# EasyEDA Pro project ProPrj_MBC5 电池 (ldo)定稿_2024-09-28.epro, schematic schematic1
Create Date: 2024-04-18; Page Name: P1; Project Name: mbc5flash 电池(ldo) test1; Schematic Name: schematic1; Update Date: 2024-04-28; Company: 嘉立创EDA; Page Size: A4; Version: V1.0
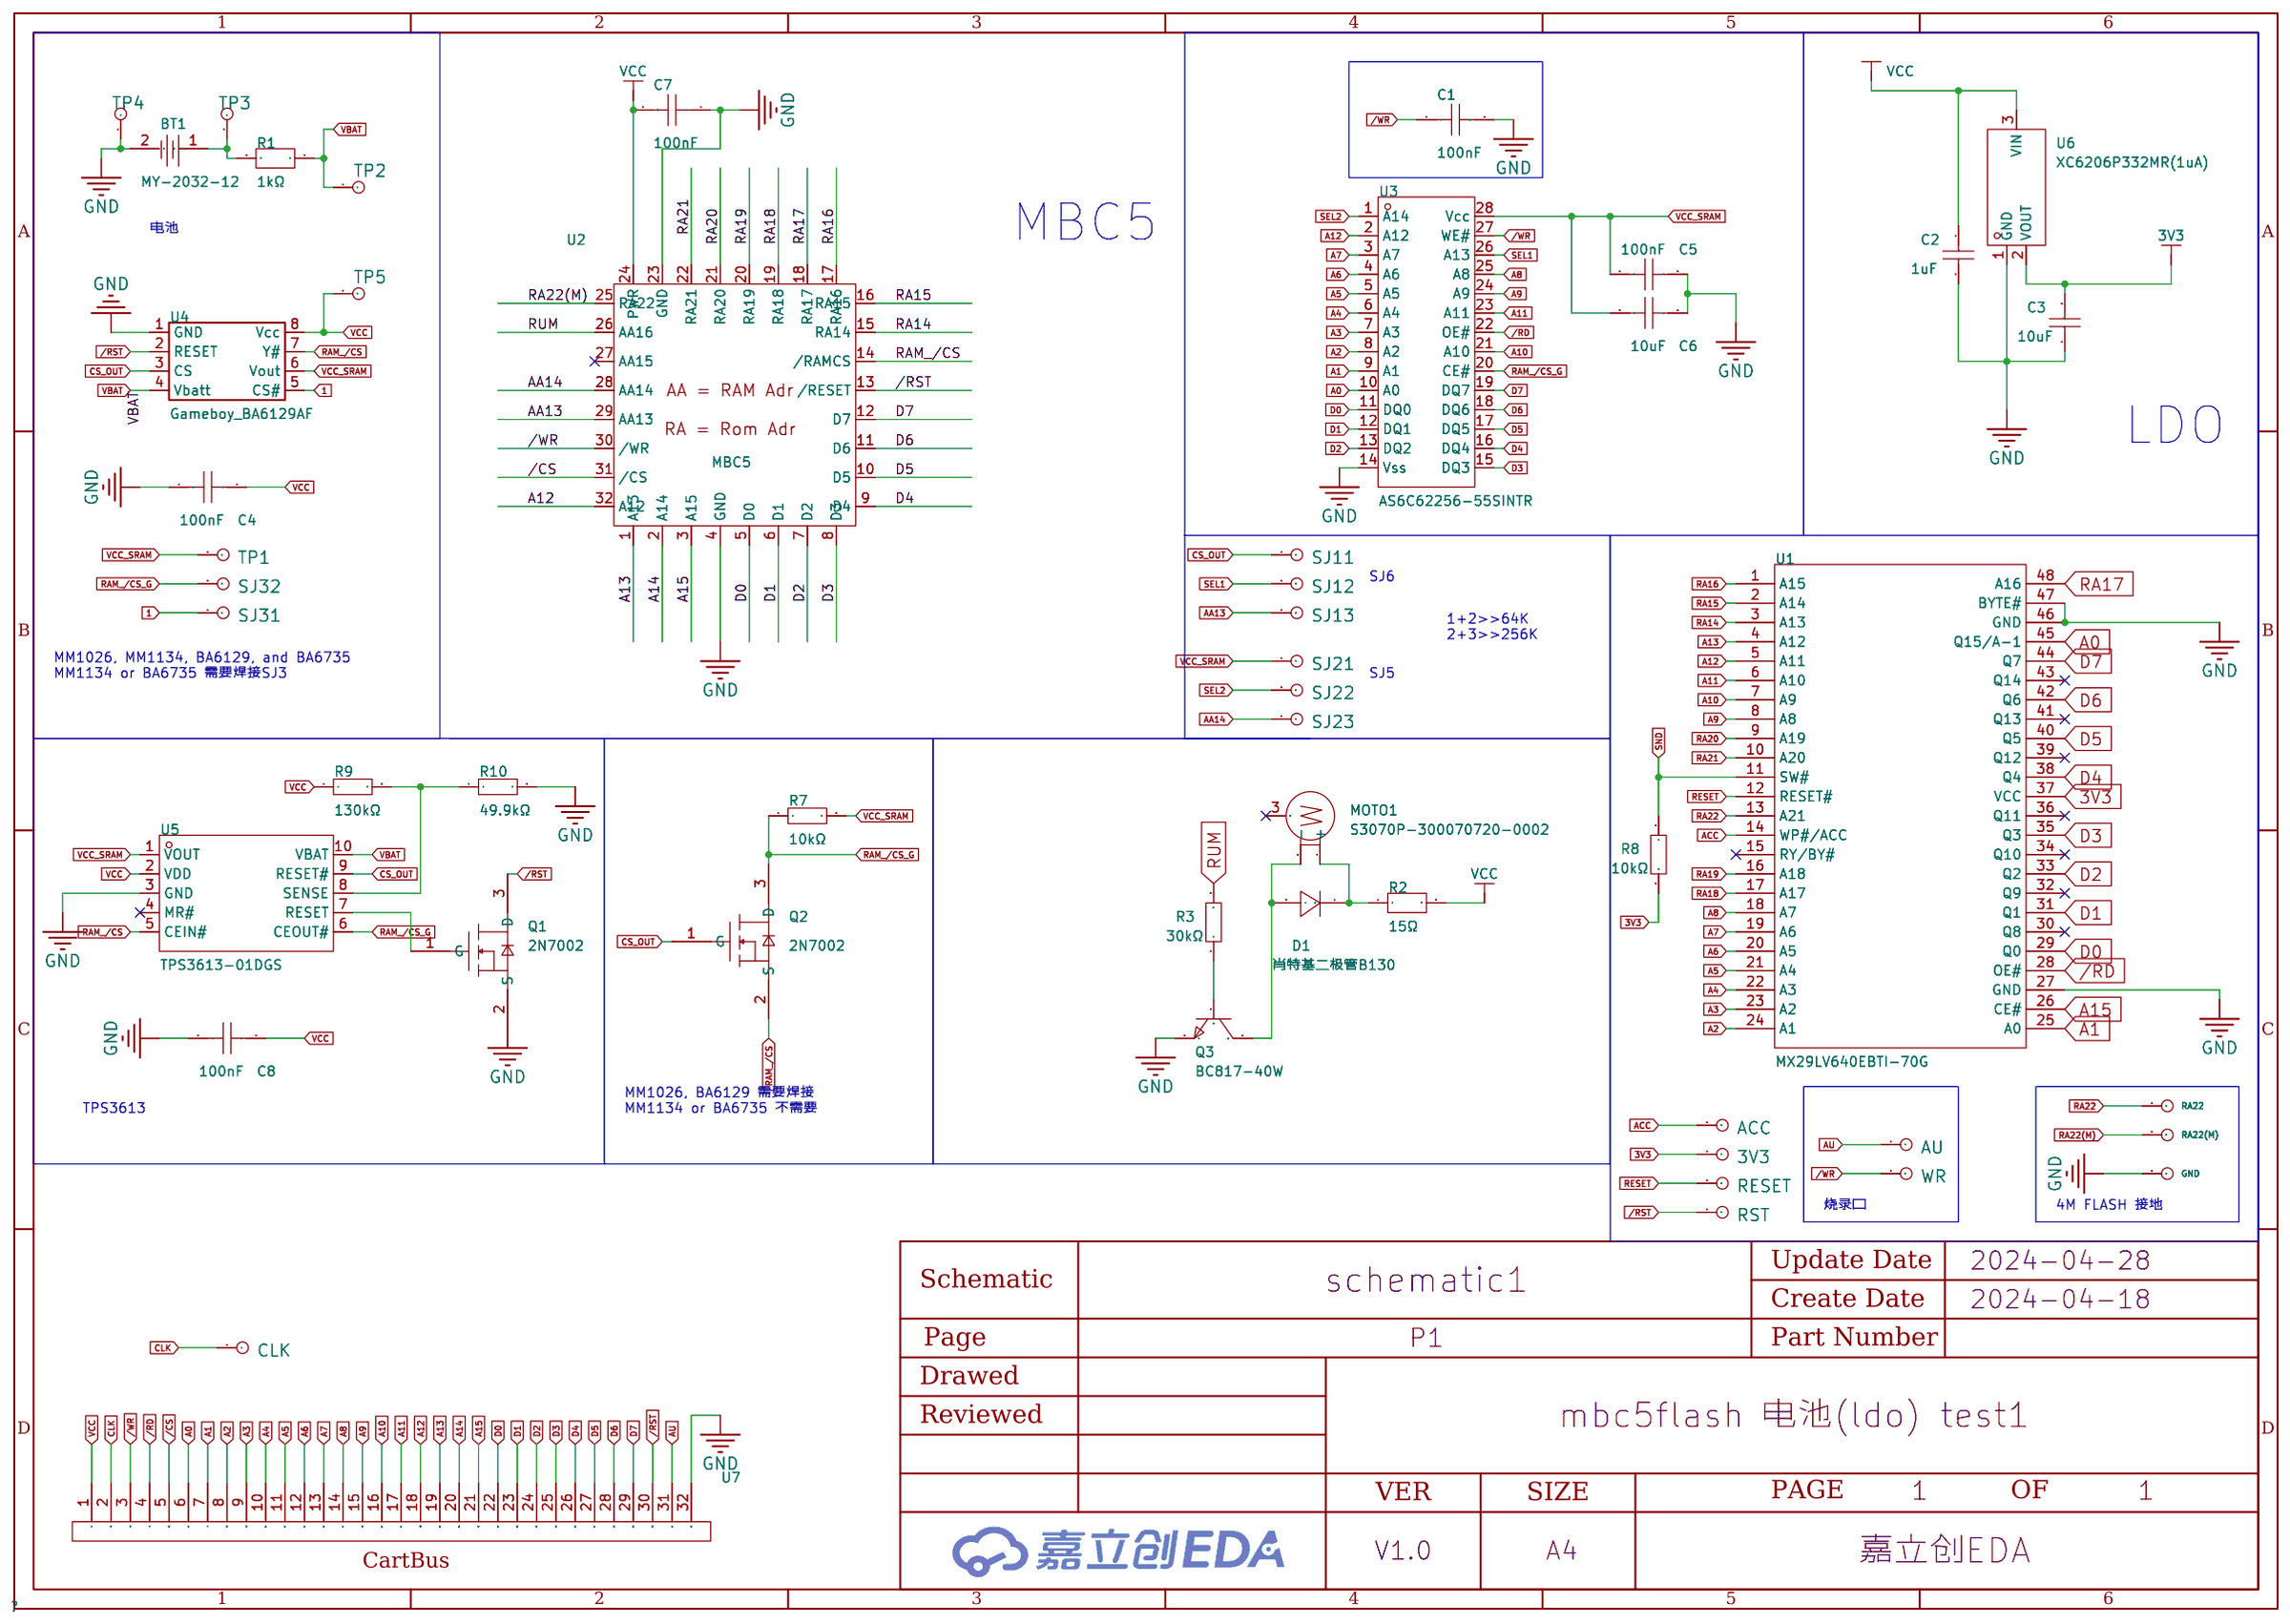
[diagram p0: schematic sheet]

## Parts
3V3  RTC_VOUT  [test_1p]
ACC  RTC_VOUT  [test_1p]
AU  RTC_VOUT  [test_1p]
BT1  MY-2032-12  [BAT-SMD_MY-2032-12]
C1  100nF  [C0603]
C2  1uF  [C0603]
C3  10uF  [C0603]
C4  100nF  [C0603]
C5  100nF  [C0603]
C6  10uF  [C0603]
C7  100nF  [C0603]
C8  100nF  [C0603]
CLK  RTC_VOUT  [test_1p]
D1  肖特基二极管B130  [SOD-123_L2.7-W1.7-LS3.8-RD]
GND  Battery_Positive_After_Resistor  [test_1p]
MOTO1  S3070P-300070720-0002  [VIBRATING-MOTOR_S3070P-300070720-0002]
Q1  2N7002  [SOT-23-3_L2.9-W1.3-P1.90-LS2.4-BR]
Q2  2N7002  [SOT-23-3_L2.9-W1.3-P1.90-LS2.4-BR]
Q3  BC817-40W  [SOT-323-3_L2.1-W1.3-P1.30-LS2.3-BR]
R1  1kΩ  [R0603]
R2  15Ω  [R0603]
R3  30kΩ  [R0603]
R7  10kΩ  [R0603]
R8  10kΩ  [R0603]
R9  130kΩ  [R0603]
R10  49.9kΩ  [R0603]
RA22  RTC_VOUT  [test_1p]
RA22(M)  RTC_VOUT  [test_1p]
RESET  RTC_VOUT  [test_1p]
RST  RTC_VOUT  [test_1p]
SJ11  RTC_VOUT  [test_1p]
SJ12  RTC_VOUT  [test_1p]
SJ13  RTC_VOUT  [test_1p]
SJ21  RTC_VOUT  [test_1p]
SJ22  RTC_VOUT  [test_1p]
SJ23  RTC_VOUT  [test_1p]
SJ31  RTC_VOUT  [test_1p]
SJ32  RTC_VOUT  [test_1p]
TP1  RTC_VOUT  [test_1p]
TP2  RTC_VOUT  [test_1p]
TP3  RTC_VOUT  [test_1p]
TP4  RTC_VOUT  [test_1p]
TP5  RTC_VOUT  [test_1p]
U1  MX29LV640EBTI-70G  [TSOP-48_L12.0-W18.4-P0.50-LS20.0-TL]
U2  MBC5  [MBC5]
U3  AS6C62256-55SINTR  [SOP-28_L18.0-W8.4-P1.27-LS11.8-BL]
U4  BA6129AF  [Package_SO:SOIC-8_3.9x4.9mm_P1.27mm]
U5  TPS3613-01DGS  [MSOP-10_L3.0-W3.0-P0.50-LS5.0-BL]
U6  XC6206P332MR(1uA)  [SOT-23-3_L2.9-W1.6-P1.90-LS2.8-BR]
U7  -  [GBGBA CARTBUS]
WR  RTC_VOUT  [test_1p]

## Library data of the parts
3V3 ACC AU CLK GND RA22 RA22(M) RESET RST SJ11-SJ13 SJ21-SJ23 SJ31 SJ32 TP1-TP5 WR = Connector_TestPoint
BT1 = MY-2032-12: LCSC Part Name: CR2032 电池扣; Supplier Part: C964833; Manufacturer: MYOUNG(美阳); Supplier Footprint: SMT; JLCPCB Part Class: Extended Part; Datasheet: https://atta.szlcsc.com/upload/public/pdf/source/20201218/C964833_8D2DD5FC6B310B5B4EFEF4B683694189.pdf; Supplier: LCSC
C1 C4 C8 = CL10B104KB8NNNC: 容值:100nF;精度:±10%;额定电压:50V;材质(温度系数):X7R;; LCSC Part Name: 100nF ±10% 50V; Supplier Part: C1591; Manufacturer: SAMSUNG(三星); Supplier Footprint: 0603; JLCPCB Part Class: Extended Part; Datasheet: https://atta.szlcsc.com/upload/public/pdf/source/20160103/1457707680512.pdf; Supplier: LCSC; Tolerance: ±10%; Voltage Rated: 50V; Temperature Coefficient: X7R
C2 C3 = CL10A105KB8NNNC: 温度系数:X5R;精度:±10%;额定电压:50V;容值:1uF;; LCSC Part Name: 1uF ±10% 50V; Supplier Part: C15849; Manufacturer: SAMSUNG(三星); Supplier Footprint: 0603; JLCPCB Part Class: Basic Part; Datasheet: https://atta.szlcsc.com/upload/public/pdf/source/20160103/1457707679084.pdf; Supplier: LCSC; Temperature Coefficient: X5R; Tolerance: ±10%; Voltage Rated: 50V
C5 = CC0603KRX7R9BB104: 容值:100nF;精度:±10%;额定电压:50V;材质(温度系数):X7R;; LCSC Part Name: 100nF ±10% 50V; Supplier Part: C14663; Manufacturer: YAGEO(国巨); Supplier Footprint: 0603; JLCPCB Part Class: 基础库; Datasheet: https://atta.szlcsc.com/upload/public/pdf/source/20180910/C282072_33301C7F631E79921B82A8DAC6BCC5B3.pdf; Supplier: LCSC; Tolerance: ±10%; Voltage Rated: 50V; Temperature Coefficient: X7R
C6 = CL10A106KP8NNNC: 容值:10uF;精度:±10%;额定电压:10V;材质(温度系数):X5R;; LCSC Part Name: 10uF ±10% 10V; Supplier Part: C19702; Manufacturer: SAMSUNG(三星); Supplier Footprint: 0603; JLCPCB Part Class: 基础库; Datasheet: https://atta.szlcsc.com/upload/public/pdf/source/20160218/1457707763339.pdf; Supplier: LCSC; Tolerance: ±10%; Voltage Rated: 10V; Temperature Coefficient: X5R
C7 = CC0603KRX7R9BB104: 容值:100nF;精度:±10%;额定电压:50V;材质(温度系数):X7R;; LCSC Part Name: 100nF ±10% 50V; Supplier Part: C14663; Manufacturer: YAGEO(国巨); Supplier Footprint: 0603; JLCPCB Part Class: Basic Part; Datasheet: https://atta.szlcsc.com/upload/public/pdf/source/20170116/1484561234239.pdf; Supplier: LCSC; Tolerance: ±10%; Voltage Rated: 50V; Temperature Coefficient: X7R
D1 = 肖特基二极管B130: Supplier Part: C9900019643; Supplier Footprint: D1005; JLCPCB Part Class: 扩展库; Supplier: LCSC
MOTO1 = S3070P-300070720-0002: 类型:扁平振动马达;额定电压:2.7V;额定转速:14000±2500rpm;旋转方向:CW;; LCSC Part Name: 实芯马达; Supplier Part: C2685995; Manufacturer: LNLON(灵龙); JLCPCB Part Class: 扩展库; Datasheet: https://atta.szlcsc.com/upload/public/pdf/source/20210121/C2685995_E06BF4A387E18BA7CEE2C0FD22C45624.pdf; Supplier: LCSC; Type: 扁平振动马达; Rated Voltage: 2.7V; Rated Current: 85mA; Rated Speed: 14000±2500rpm; Operating Temperature: -20℃~+70℃; Sense Of Rotation: CW
Q1 Q2 = 2N7002_C916396: 类型:N沟道;漏源电压(Vdss):60V;连续漏极电流(Id):115mA;功率(Pd):200mW;导通电阻(RDS(on)@Vgs,Id):1.2Ω@10V,500mA;阈值电压(Vgs(th)@Id):2.1V@250uA;; LCSC Part Name: N沟道 耐压:60V 电流:115mA; Supplier Part: C916396; Manufacturer: JSMSEMI(杰盛微); Supplier Footprint: SOT-23; JLCPCB Part Class: 扩展库; Datasheet: https://atta.szlcsc.com/upload/public/pdf/source/20230714/89F30C6A193AD72E5F1F14B53E304F4A.pdf; Supplier: LCSC; Type: N沟道; Drain Source Voltage (Vdss): 60V; Continuous Drain Current (Id): 115mA; Power Dissipation (Pd): 200mW; Drain Source On Resistance (RDS(on)@Vgs,Id): 1.2Ω@10V,500mA; Gate Threshold Voltage (Vgs(th)@Id): 2.1V@250uA; Input Capacitance (Ciss@Vds): 20pF@25V; Reverse Transfer Capacitance (Crss@Vds): 4pF@25V
Q3 = BC817-40W_C17703043: 晶体管类型:NPN;集电极电流(Ic):500mA;集射极击穿电压(Vceo):45V;功率(Pd):200mW;; LCSC Part Name: 耐压:45V 电流:500mA NPN; Supplier Part: C17703043; Manufacturer: MSKSEMI(美森科); Supplier Footprint: SOT-323; Datasheet: https://atta.szlcsc.com/upload/public/pdf/source/20230927/BC1FC2DBB8D608A648B3A61BC7D80A24.pdf; Supplier: LCSC; Transistor Type: NPN; Collector Current (Ic): 500mA; Collector-Emitter Breakdown Voltage (Vceo): 45V; Power Dissipation (Pd): 200mW
R1 = ERA3VEB1001V: 温度系数:±25ppm/K;温度系数:±25ppm/K;工作温度范围:-55℃~+155℃;工作温度范围:-55℃~+155℃;精度:±0.1%;最大工作电压:100V;类型:薄膜电阻;功率:125mW;阻值:1kΩ;; LCSC Part Name: 1KΩ(1001) ±0.1%; Supplier Part: C490794; Manufacturer: PANASONIC(松下); Supplier Footprint: 0603; JLCPCB Part Class: Extended Part; Datasheet: https://atta.szlcsc.com/upload/public/pdf/source/20200407/C490794_144E786BD6B5906C11E86C00580B1EF5.pdf; Supplier: LCSC; Temperature Coefficient: ±25ppm/K; Operating Temperature Range: -55℃~+155℃; Tolerance: ±0.1%; Overload Voltage (Max): 100V; Type: 薄膜电阻; Power(Watts): 125mW
R2 = SCR0603J15R: 电阻类型:厚膜电阻;阻值:15Ω;精度:±5%;功率:100mW;最大工作电压:75V;; LCSC Part Name: 厚膜电阻 15Ω ±5% 100mW; Supplier Part: C3017777; Manufacturer: VO(翔胜); Supplier Footprint: 0603; JLCPCB Part Class: 扩展库; Datasheet: https://atta.szlcsc.com/upload/public/pdf/source/20220513/247AF9639BA21CF93567DC289CCC6A22.pdf; Supplier: LCSC; Type: 厚膜电阻; Tolerance: ±5%; Power(Watts): 100mW; Overload Voltage (Max): 75V; Operating Temperature Range: -55℃~+155℃
R3 = ERJPA3F3002V: 电阻类型:厚膜电阻;阻值:30kΩ;精度:±1%;功率:250mW;最大工作电压:-;温度系数:±100ppm/℃;; LCSC Part Name: 30kΩ ±1% 250mW 厚膜电阻; Supplier Part: C543380; Manufacturer: PANASONIC(松下); Supplier Footprint: 0603; JLCPCB Part Class: 扩展库; Datasheet: https://atta.szlcsc.com/upload/public/pdf/source/20200515/C543414_D3FB4A44C151AC19BA141503575FC797.pdf; Supplier: LCSC; Type: 厚膜电阻; Tolerance: ±1%; Power(Watts): 250mW; Temperature Coefficient: ±100ppm/℃; Operating Temperature Range: -55℃~+155℃
R7 R8 = 0603WAF1002T5E: 电阻类型:厚膜电阻;阻值:10kΩ;精度:±1%;功率:100mW;温度系数:±100ppm/℃;最大工作电压:75V;工作温度范围:-55℃~+155℃;; LCSC Part Name: 10kΩ ±1% 100mW; Supplier Part: C25804; Manufacturer: UNI-ROYAL(厚声); Supplier Footprint: 0603; JLCPCB Part Class: Basic Part; Datasheet: https://atta.szlcsc.com/upload/public/pdf/source/20200306/C422600_1E6D84923E4A46A82E41ADD87F860B5C.pdf; Supplier: LCSC; Type: 厚膜电阻; Tolerance: ±1%; Power(Watts): 100mW; Temperature Coefficient: ±100ppm/℃; Overload Voltage (Max): 75V; Operating Temperature Range: -55℃~+155℃
R9 = 0603WAF1303T5E: 电阻类型:厚膜电阻;阻值:130kΩ;精度:±1%;功率:100mW;最大工作电压:75V;温度系数:±100ppm/℃;; LCSC Part Name: 130kΩ ±1% 100mW 厚膜电阻; Supplier Part: C22795; Manufacturer: UNI-ROYAL(厚声); Supplier Footprint: 0603; JLCPCB Part Class: 扩展库; Datasheet: https://atta.szlcsc.com/upload/public/pdf/source/20200306/C422600_1E6D84923E4A46A82E41ADD87F860B5C.pdf; Supplier: LCSC; Type: 厚膜电阻; Tolerance: ±1%; Power(Watts): 100mW; Overload Voltage (Max): 75V; Temperature Coefficient: ±100ppm/℃; Operating Temperature Range: -55℃~+155℃
R10 = 0603WAF4992T5E: 电阻类型:厚膜电阻;阻值:49.9kΩ;精度:±1%;功率:100mW;最大工作电压:75V;温度系数:±100ppm/℃;; LCSC Part Name: 49.9kΩ ±1% 100mW 厚膜电阻; Supplier Part: C23184; Manufacturer: UNI-ROYAL(厚声); Supplier Footprint: 0603; JLCPCB Part Class: 基础库; Datasheet: https://atta.szlcsc.com/upload/public/pdf/source/20200306/C422600_1E6D84923E4A46A82E41ADD87F860B5C.pdf; Supplier: LCSC; Type: 厚膜电阻; Tolerance: ±1%; Power(Watts): 100mW; Overload Voltage (Max): 75V; Temperature Coefficient: ±100ppm/℃; Operating Temperature Range: -55℃~+155℃
U1 = MX29LV640EBTI-70G: 64-Mbit(8M x 8bit/4M x 16bit)，工作电压：2.7V to 3.6V; Supplier Part: C30076; Manufacturer: MXIC(旺宏电子); Supplier Footprint: TSOPI-48; JLCPCB Part Class: 扩展库; Datasheet: https://atta.szlcsc.com/upload/public/pdf/source/20140417/1457707044232.pdf; Supplier: LCSC
U2 = MBC5
U3 = AS6C62256-55SINTR: LCSC Part Name: AS6C62256 55SINTR; Supplier Part: C1858331; Manufacturer: Alliance Memory; Supplier Footprint: SOP-28-8.4mm; JLCPCB Part Class: 扩展库; Datasheet: https://atta.szlcsc.com/upload/public/pdf/source/20210505/A57C33C76897483B08DD4B91757DEAC7.pdf; Supplier: LCSC
U4 = BA6129AF
U5 = TPS3613-01DGS: 复位有效电平:低电平有效；高电平有效;受监控电压数:1;复位超时:60ms;; Supplier Part: C2867167; Manufacturer: TI(德州仪器); Supplier Footprint: MSOP-10; JLCPCB Part Class: 扩展库; Datasheet: https://www.ti.com/cn/lit/gpn/tps3613-01; Supplier: LCSC; ChipType: 电池备用电路; Output Type: 推挽; Reset Active Level: 低电平有效；高电平有效; Number of Voltages Monitored: 1; Reset Timeout: 60ms; Operating Temperature: -40℃~+85℃@(TA)
U6 = XC6206P332MR(1uA): 输出类型:-;; Supplier Part: C2827648; Manufacturer: TECH PUBLIC(台舟); Supplier Footprint: SOT-23-3L; JLCPCB Part Class: Extended Part; Datasheet: https://atta.szlcsc.com/upload/public/pdf/source/20210810/97CC0812A7725EE2472CEA147F9F2323.pdf; Supplier: LCSC
U7 = GB GBA CartBus

## Nets
3V3: 3V3.1 C3.2 R8.2 U1.37(VCC) U6.2(VOUT)
GND: BT1.2 C1.2 C2.1 C3.1 C4.1 C5.2 C6.2 C7.1 C8.1 GND.1 Q1.2(S) Q3.2(E) R10.2 TP4.1 U1.27(GND) U1.46(GND) U1.47(BYTE#) U2.4(GND) U2.23(GND) U3.14(Vss) U4.1(GND) U5.3(GND) U6.1(GND) U7.32
VBAT: R1.1 TP2.1 U4.4(Vbatt) U5.10(VBAT)
VCC: C2.2 C4.2 C7.2 C8.2 R2.2 R9.1 TP5.1 U2.24(PWR) U4.8(Vcc) U5.2(VDD) U6.3(VIN) U7.1
VCC_SRAM: C5.1 C6.1 R7.2 SJ21.1 TP1.1 U3.28(Vcc) U4.6(Vout) U5.1(VOUT)
1: SJ31.1 U4.5(CS#)
/CS: U2.31(/CS) U7.5
/RD: U1.28(OE#) U3.22(OE#) U7.4
/RST: Q1.3(D) RST.1 U2.13(/RESET) U4.2(RESET) U7.30
/WR: C1.1 U2.30(/WR) U3.27(WE#) U7.3 WR.1
A0: U1.45(Q15/A-1) U3.10(A0) U7.6
A1: U1.25(A0) U3.9(A1) U7.7
A2: U1.24(A1) U3.8(A2) U7.8
A3: U1.23(A2) U3.7(A3) U7.9
A4: U1.22(A3) U3.6(A4) U7.10
A5: U1.21(A4) U3.5(A5) U7.11
A6: U1.20(A5) U3.4(A6) U7.12
A7: U1.19(A6) U3.3(A7) U7.13
A8: U1.18(A7) U3.25(A8) U7.14
A9: U1.8(A8) U3.24(A9) U7.15
A10: U1.7(A9) U3.21(A10) U7.16
A11: U1.6(A10) U3.23(A11) U7.17
A12: U1.5(A11) U2.32(A12) U3.2(A12) U7.18
A13: U1.4(A12) U2.1(A13) U7.19
A14: U2.2(A14) U7.20
A15: U1.26(CE#) U2.3(A15) U7.21
AA13: SJ13.1 U2.29(AA13)
AA14: SJ23.1 U2.28(AA14)
ACC: ACC.1 U1.14(WP#/ACC)
AU: AU.1 U7.31
CLK: CLK.1 U7.2
CS_OUT: Q2.1(G) SJ11.1 U4.3(CS) U5.9(RESET#)
D0: U1.29(Q0) U2.5(D0) U3.11(DQ0) U7.22
D1: U1.31(Q1) U2.6(D1) U3.12(DQ1) U7.23
D2: U1.33(Q2) U2.7(D2) U3.13(DQ2) U7.24
D3: U1.35(Q3) U2.8(D3) U3.15(DQ3) U7.25
D4: U1.38(Q4) U2.9(D4) U3.16(DQ4) U7.26
D5: U1.40(Q5) U2.10(D5) U3.17(DQ5) U7.27
D6: U1.42(Q6) U2.11(D6) U3.18(DQ6) U7.28
D7: U1.44(Q7) U2.12(D7) U3.19(DQ7) U7.29
RA14: U1.3(A13) U2.15(RA14)
RA15: U1.2(A14) U2.16(RA15)
RA16: U1.1(A15) U2.17(RA16)
RA17: U1.48(A16) U2.18(RA17)
RA18: U1.17(A17) U2.19(RA18)
RA19: U1.16(A18) U2.20(RA19)
RA20: U1.9(A19) U2.21(RA20)
RA21: U1.10(A20) U2.22(RA21)
RA22: RA22.1 U1.13(A21)
RA22(M): RA22(M).1 U2.25(RA22)
RAM_/CS: Q2.2(S) U2.14(/RAMCS) U4.7(Y#) U5.5(CEIN#)
RAM_/CS_G: Q2.3(D) R7.1 SJ32.1 U3.20(CE#) U5.6(CEOUT#)
RESET: RESET.1 U1.12(RESET#)
RUM: R3.2 U2.26(AA16)
SEL1: SJ12.1 U3.26(A13)
SEL2: SJ22.1 U3.1(A14)
SND: R8.1 U1.11(SW#)
Net-(BT1-1): BT1.1 R1.2 TP3.1
Net-(D1-1): D1.1(C) MOTO1.1(+) R2.1
Net-(D1-2): D1.2(A) MOTO1.2(-) Q3.3(C)
Net-(Q1-1): Q1.1(G) U5.7(RESET)
Net-(Q3-1): Q3.1(B) R3.1
Net-(R9-2): R9.2 R10.1 U5.8(SENSE)

Not connected (* = marked no-connect by the designer): MOTO1 3(EP)*; U1 15(RY/BY#)* 30(Q8)* 32(Q9)* 34(Q10)* 36(Q11)* 39(Q12)* 41(Q13)* 43(Q14)*; U2 27(AA15)*; U5 4(MR#)*

## Notes on the sheet
- 电池
- MBC5
- LDO
- SJ6
- 1+2>>64K
  2+3>>256K
- MM1026, MM1134, BA6129, and BA6735
  MM1134 or BA6735 需要焊接SJ3
- SJ5
- TPS3613
- MM1026, BA6129 需要焊接
  MM1134 or BA6735 不需要
- 烧录口
- 4M FLASH 接地
